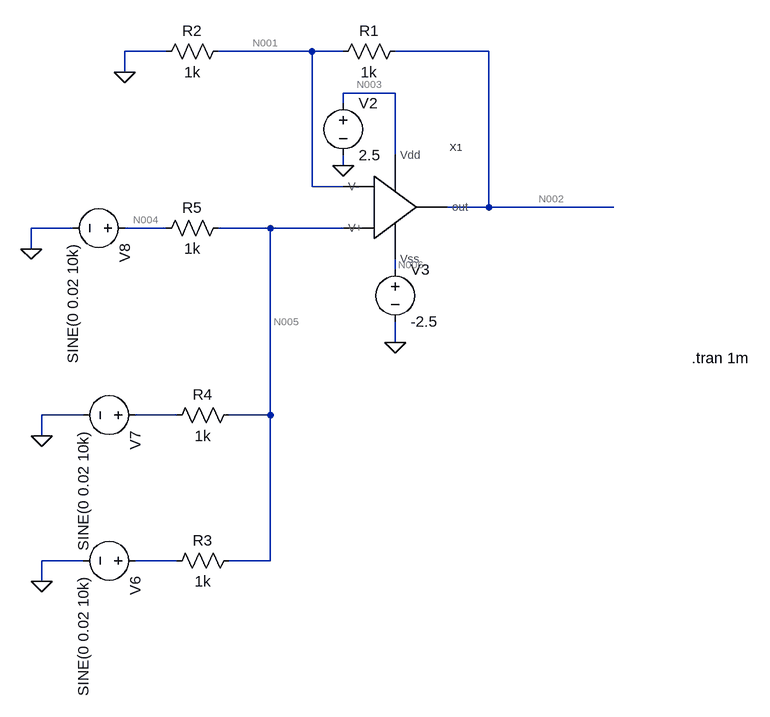
[diagram p0: schematic Draft9.asc]
Draft9.asc, the LTspice schematic file:
Version 4
SHEET 1 880 1236
WIRE -96 -96 -160 -96
WIRE 128 -96 -16 -96
WIRE 176 -96 128 -96
WIRE 400 -96 256 -96
WIRE -160 -64 -160 -96
WIRE 256 -32 176 -32
WIRE 176 -16 176 -32
WIRE 256 64 256 -32
WIRE 176 80 176 64
WIRE 128 112 128 -96
WIRE 176 112 128 112
WIRE 400 144 400 -96
WIRE 400 144 336 144
WIRE 592 144 400 144
WIRE -240 176 -304 176
WIRE -96 176 -160 176
WIRE 64 176 -16 176
WIRE 176 176 64 176
WIRE -304 208 -304 176
WIRE 256 240 256 224
WIRE 256 352 256 320
WIRE -224 464 -288 464
WIRE -80 464 -144 464
WIRE 64 464 64 176
WIRE 64 464 0 464
WIRE -288 496 -288 464
WIRE -224 688 -288 688
WIRE -80 688 -144 688
WIRE 64 688 64 464
WIRE 64 688 0 688
WIRE -288 720 -288 688
FLAG 256 352 0
FLAG 176 80 0
FLAG -160 -64 0
FLAG -288 720 0
FLAG -288 496 0
FLAG -304 208 0
SYMBOL res 272 -112 R90
WINDOW 0 0 56 VBottom 2
WINDOW 3 32 56 VTop 2
SYMATTR InstName R1
SYMATTR Value 1k
SYMBOL voltage 176 -32 R0
WINDOW 123 0 0 Left 0
WINDOW 39 0 0 Left 0
SYMATTR InstName V2
SYMATTR Value 2.5
SYMBOL voltage 256 224 R0
WINDOW 123 0 0 Left 0
WINDOW 39 0 0 Left 0
SYMATTR InstName V3
SYMATTR Value -2.5
SYMBOL res 0 -112 R90
WINDOW 0 0 56 VBottom 2
WINDOW 3 32 56 VTop 2
SYMATTR InstName R2
SYMATTR Value 1k
SYMBOL OPAMP 144 144 R0
SYMATTR InstName X1
SYMBOL voltage -128 688 R90
WINDOW 123 24 44 Left 2
WINDOW 39 0 0 Left 0
SYMATTR InstName V6
SYMATTR Value SINE(0 0.02 10k)
SYMBOL res 16 672 R90
WINDOW 0 0 56 VBottom 2
WINDOW 3 32 56 VTop 2
SYMATTR InstName R3
SYMATTR Value 1k
SYMBOL voltage -128 464 R90
WINDOW 123 24 44 Left 2
WINDOW 39 0 0 Left 0
SYMATTR InstName V7
SYMATTR Value SINE(0 0.02 10k)
SYMBOL res 16 448 R90
WINDOW 0 0 56 VBottom 2
WINDOW 3 32 56 VTop 2
SYMATTR InstName R4
SYMATTR Value 1k
SYMBOL voltage -144 176 R90
WINDOW 123 24 44 Left 2
WINDOW 39 0 0 Left 0
SYMATTR InstName V8
SYMATTR Value SINE(0 0.02 10k)
SYMBOL res 0 160 R90
WINDOW 0 0 56 VBottom 2
WINDOW 3 32 56 VTop 2
SYMATTR InstName R5
SYMATTR Value 1k
TEXT 712 376 Left 2 !.tran 1m

The netlist it stands for:
* Draft9.asc
R1 N002 N001 1k
V2 N003 0 2.5
V3 N006 0 -2.5
R2 N001 0 1k
XX1 N003 N006 N001 N005 N002 OPAMP  ; pins Vdd Vss V- V+ out
V6 N008 0 SINE(0 0.02 10k)
R3 N005 N008 1k
V7 N007 0 SINE(0 0.02 10k)
R4 N005 N007 1k
V8 N004 0 SINE(0 0.02 10k)
R5 N005 N004 1k
.tran 1m
.backanno
.end

* Results of the author's LTspice run, read from the files saved beside the schematic
* Operating Point, zero values left out:
*   V(n002) = 95.18 µV
*   V(n001) = 47.59 µV
*   V(n003) = 2.5 V
*   V(n006) = -2.5 V
*   I(R1) = 47.59 nA
*   I(R2) = 47.59 nA
*   I(V2) = -188.5 µA
*   I(V3) = 188.4 µA
*   Ix(x1:VDD) = 188.5 µA
*   Ix(x1:VSS) = -188.4 µA
*   Ix(x1:OUT) = -47.59 nA
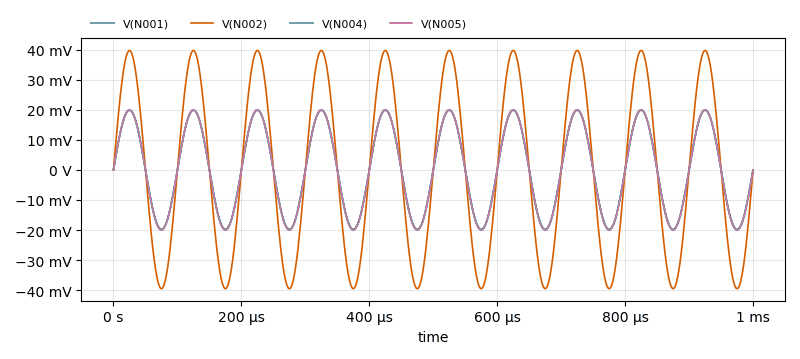
[diagram p1: Transient Analysis of Draft9.asc, plotted from the saved traces]
* Transient Analysis, 1 run:
*   V(N001): min -19.78 mV, max 19.88 mV, average 50.38 µV, rms 14.02 mV, last -33.36 µV
*   V(N002): min -39.55 mV, max 39.77 mV, average 100.8 µV, rms 28.05 mV, last -66.71 µV
*   V(N004): min -20 mV, max 20 mV, average -12.38 nV, rms 14.14 mV, last 0 V
*   V(N005): min -19.98 mV, max 19.98 mV, average -11.51 nV, rms 14.13 mV, last 0 V